# EAGLE design rx (EAGLE 9.1.3)
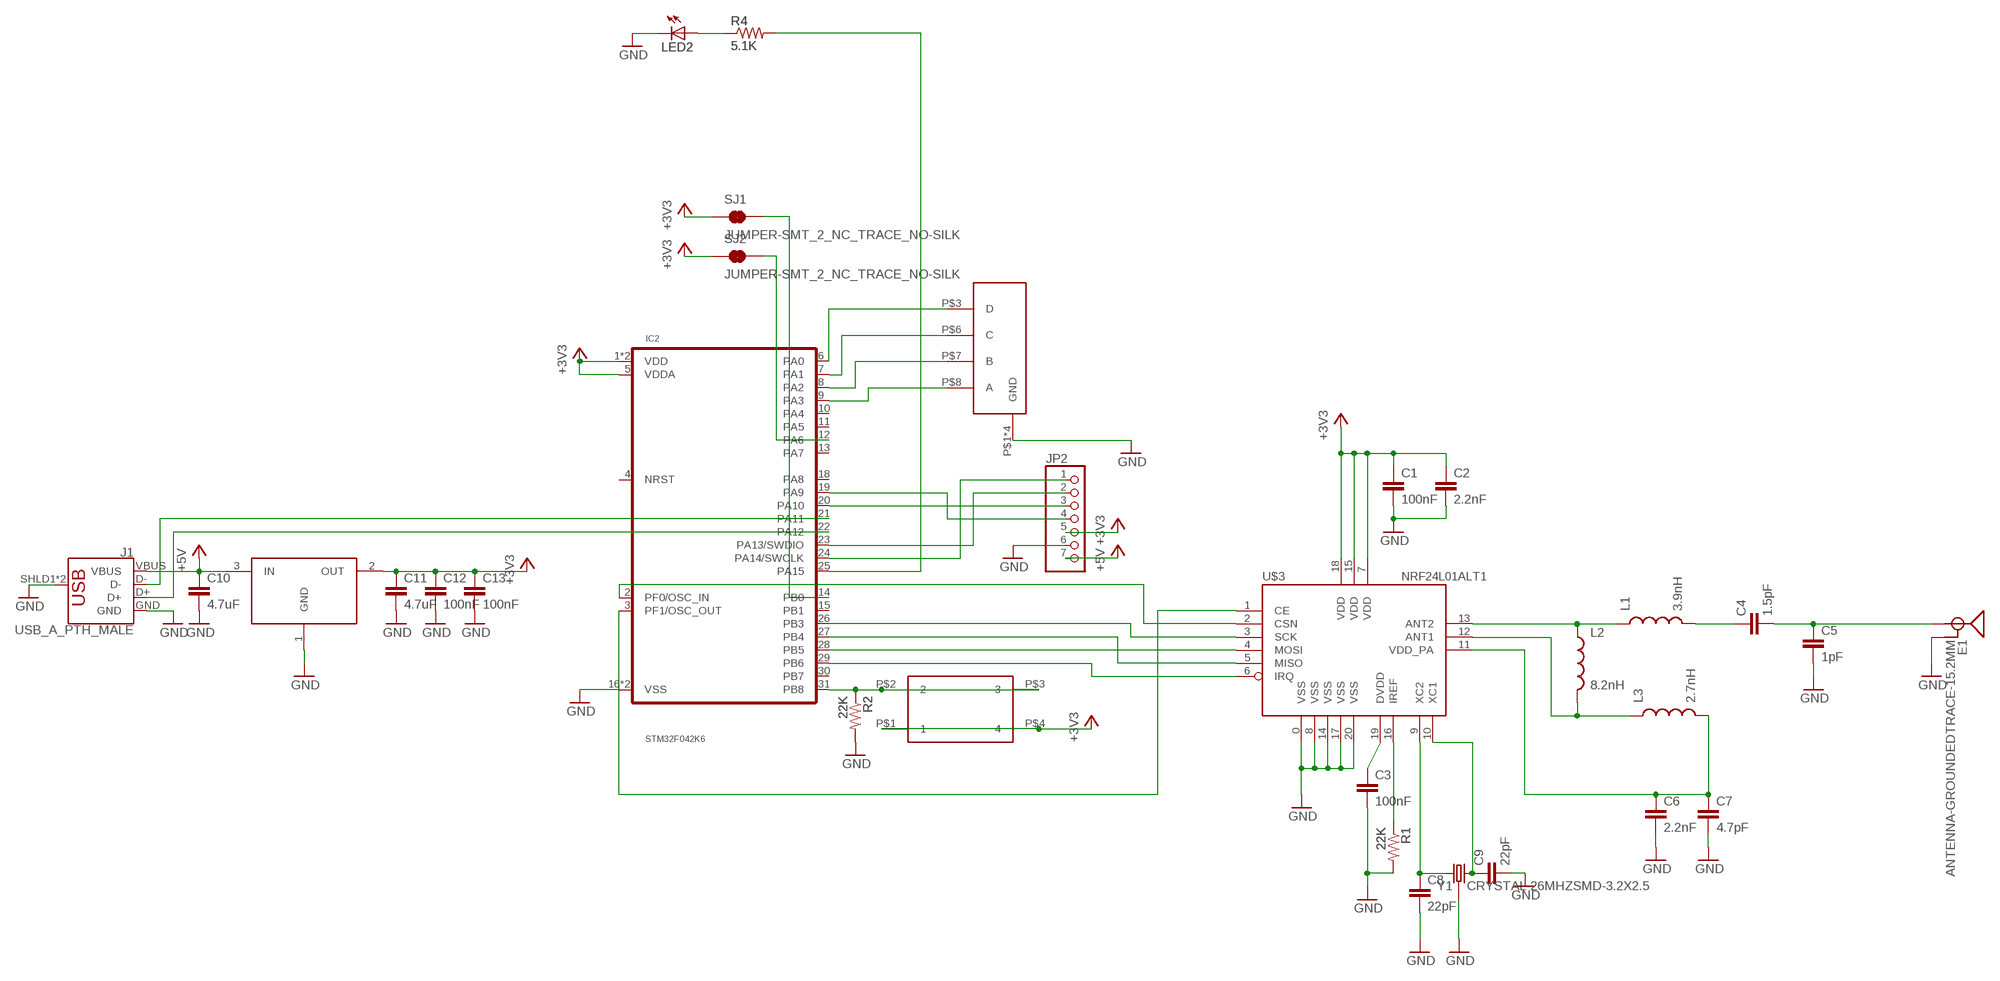
[diagram p0: schematic, sheet 1]

## Parts
C1  100nF  CAP0805  [0805]
C2  2.2nF  CAP0805  [0805]
C3  100nF  CAP0805  [0805]
C4  1.5pF  CAP0805  [0805]
C5  1pF  CAP0805  [0805]
C6  2.2nF  CAP0805  [0805]
C7  4.7pF  CAP0805  [0805]
C8  22pF  CAP0805  [0805]
C9  22pF  CAP0805  [0805]
C10  4.7uF  CAP0805  [0805]
C11  4.7uF  CAP0805  [0805]
C12  100nF  CAP0805  [0805]
C13  100nF  CAP0805  [0805]
E1  ANTENNA-GROUNDEDTRACE-15.2MM  [TRACE_ANTENNA_2.4GHZ_15.2MM]
IC2  STM32F042K6  [TQFP32-08]
J1  USB_A_PTH_MALE  [USB-A-H]
JP2  PINHD-1X8CLEANBIG  [1X08-CLEANBIG]
L1  3.9nH  INDUCTOR0805  [0805]
L2  8.2nH  INDUCTOR0805  [0805]
L3  2.7nH  INDUCTOR0805  [0805]
LED2  LEDCHIP-LED0805  [CHIP-LED0805]
R1  22K  RESISTOR0805-RES  [0805]
R2  22K  RESISTOR0805-RES  [0805]
R4  5.1K  RESISTOR0805-RES  [0805]
SJ1  JUMPER-SMT_2_NC_TRACE_NO-SILK  [SMT-JUMPER_2_NC_TRACE_NO-SILK]
SJ2  JUMPER-SMT_2_NC_TRACE_NO-SILK  [SMT-JUMPER_2_NC_TRACE_NO-SILK]
U$1  SW_3POS_DEVSW_3POS_OFFICIAL  [SW_3POS_FOOT_OFFICIAL]
U$3  NRF24L01ALT1  [QFN20_ALT1]
U$4  XC6206_DEV  [SOT23R_INFINEON]
U$10  324_SW  [342_SWICH_FOOT]
Y1  CRYSTAL-26MHZSMD-3.2X2.5  [CRYSTAL-SMD-3.2X2.5MM]

## Nets
+3V3: C1.1 C2.1 C11.1 C12.1 C13.1 IC2.1(VDD) IC2.5(VDDA) IC2.17(VDD) JP2.5 SJ1.1 SJ2.1 U$3.7(VDD) U$3.15(VDD) U$3.18(VDD) U$4.2(OUT) U$10.P$1 U$10.P$4
+5V: C10.1 J1.VBUS JP2.7 U$4.3(IN)
GND: C1.2 C2.2 C3.2 C5.2 C6.2 C7.2 C8.2 C9.2 C10.2 C11.2 C12.2 C13.2 E1.GND IC2.16(VSS) IC2.32(VSS) J1.GND J1.SHLD1(SHIELD) J1.SHLD2(SHIELD) JP2.6 LED2.C R1.2 R2.2 U$1.P$1(GND) U$1.P$2(GND) U$1.P$4(GND) U$1.P$5(GND) U$3.0(VSS) U$3.8(VSS) U$3.14(VSS) U$3.17(VSS) U$3.20(VSS) U$4.1(GND) Y1.2 Y1.4
N$1: C3.1 U$3.19(DVDD)
N$2: R1.1 U$3.16(IREF)
N$3: L1.1 L2.1 U$3.13(ANT2)
N$4: C4.1 L1.2
N$5: C4.2 C5.1 E1.ANT(SIGNAL)
N$6: L2.2 L3.1 U$3.12(ANT1)
N$7: C8.1 U$3.9(XC2) Y1.1
N$8: C6.1 C7.1 L3.2 U$3.11(VDD_PA)
N$9: C9.1 U$3.10(XC1) Y1.3
N$10: IC2.6(PA0) U$1.P$3(D)
N$11: IC2.31(PB8) R2.1 U$10.P$2 U$10.P$3
N$12: IC2.21(PA11) J1.D-
N$13: IC2.22(PA12) J1.D+
N$14: IC2.28(PB5) U$3.4(MOSI)
N$15: IC2.27(PB4) U$3.5(MISO)
N$16: IC2.26(PB3) U$3.3(SCK)
N$17: IC2.29(PB6) U$3.6(IRQ)
N$18: LED2.A R4.1
N$20: IC2.2(PF0/OSC_IN) U$3.2(CSN)
N$21: IC2.3(PF1/OSC_OUT) U$3.1(CE)
N$22: IC2.24(PA14/SWCLK) JP2.1
N$23: IC2.23(PA13/SWDIO) JP2.2
N$24: IC2.20(PA10) JP2.3
N$25: IC2.19(PA9) JP2.4
N$26: IC2.7(PA1) U$1.P$6(C)
N$27: IC2.8(PA2) U$1.P$7(B)
N$28: IC2.9(PA3) U$1.P$8(A)
N$29: IC2.25(PA15) R4.2
N$33: IC2.12(PA6) SJ2.2
N$34: IC2.14(PB0) SJ1.2
Unconnected: IC2.4(NRST) IC2.10(PA4) IC2.11(PA5) IC2.13(PA7) IC2.15(PB1) IC2.18(PA8) IC2.30(PB7)

## Library data of the parts
C1-C13 = clock:CAP: Capacitor Standard 0603 ceramic capacitor, and 0.1" leaded capacitor.
E1 = SparkFun-RF:ANTENNA-GROUNDED: Antenna w/ Ground Connection 2.4GHz antennae with signal and ground terminals. TRACE_ANTENNA_2.4GHZ_15.2MM - Meander Trace antenna 15.2 x 5.7mm footprint Based on layout from TI app note AN043 <http://www.ti.com/lit/an/swra117d/swra117d.pdf>. TRACE_ANTENNA_2.4GHZ_25.7MM - Inverted F trace antenna 25.7 x 7.5 mm footprint. Based on layout from TI design note DN0007 <http://www.ti.com/lit/an/swru120b/swru120b.pdf>.
IC2 = nixx:STM32F042K6
J1 = SparkFun-Connectors:USB_A: USB-A Connector Male and female variants, as well as PTH and SMT variants SparkFun Products: SparkFun XBee Explorer Dongle <https://www.sparkfun.com/products/11697> PTH Male SparkFun MicroView-USB Programmer <https://www.sparkfun.com/products/12924> SMT Male SparkFun USB Type A Female Breakout <https://www.sparkfun.com/products/12700> SMT Female; PROD_ID: CONN-08367; SF_ID: PRT-00437
JP2 = adafruit_changed:PINHD-1X8: PIN HEADER
L1-L3 = basicBoard:INDUCTOR: Inductors Basic Inductor/Choke - 0603 and 1206. Footprints are not proven and vary greatly between part numbers. INDUCTOR POWER 3.3UH 4.0A SMD 0.197" L x 0.197" W x 0.177" H (5.00mm x 5.00mm x 4.50mm)
LED2 = joyAnalog:LED: LED OSRAM: - CHIPLED LG R971, LG N971, LY N971, LG Q971, LY Q971, LO R971, LY R971 LH N974, LH R974 LS Q976, LO Q976, LY Q976 LO Q996 - Hyper CHIPLED LW Q18S LB Q993, LB Q99A, LB R99A - SideLED LS A670, LO A670, LY A670, LG A670, LP A670 LB A673, LV A673, LT A673, LW A673 LH A674 LY A675 LS A676, LA A676, LO A676, LY A676, LW A676 LS A679, LY A679, LG A679 - Hyper Micro SIDELED® LS Y876, LA Y876, LO Y876, LY Y876 LT Y87S - SmartLED LW L88C, LW L88S LB L89C, LB L89S, LG L890 LS L89K, LO L89K, LY L89K LS L896, LA L896, LO L896, LY L896 - TOPLED LS T670, LO T670, LY T670, LG T670, LP T670 LSG T670, LSP T670, LSY T670, LOP T670, LYG T670 LG T671, LOG T671, LSG T671 LB T673, LV T673, LT T673, LW T673 LH T674 LS T676, LA T676, LO T676, LY T676, LB T676, LH T676, LSB T676, LW T676 LB T67C, LV T67C, LT T67C, LS T67K, LO T67K, LY T67K, LW E67C LS E67B, LA E67B, LO E67B, LY E67B, LB E67C, LV E67C, LT E67C LW T67C LS T679, LY T679, LG T679 LS T770, LO T770, LY T770, LG T770, LP T770 LB T773, LV T773, LT T773, LW T773 LH T774 LS E675, LA E675, LY E675, LS T675 LS T776, LA T776, LO T776, LY T776, LB T776 LHGB T686 LT T68C, LB T68C - Hyper Mini TOPLED® LB M676 - Mini TOPLED Santana® LG M470 LS M47K, LO M47K, LY M47K Source: http://www.osram.convergy.de/
R1 R2 R4 = joyAnalog:RESISTOR: Resistor Basic schematic elements and footprints for 0603, 1206, and PTH resistors.
SJ1 SJ2 = SparkFun-Jumpers:JUMPER-SMT_2_NC_TRACE: Normally closed trace jumper This jumper has a trace between two pads so it's normally closed (NC). Use a razor knife to open the connection. For best results follow the IPC guidelines for cutting traces: Cutout at least 0.063 mm (0.005 in). Remove all loose material to clean up the cut area. Seal the cut with an approved epoxy. Reapply solder to reclose the connection.
U$1 = 3pos_slide_switch:SW_3POS_DEV
U$3 = nRF24L01-Chip-v13:NRF24L01: 2.4GHz Low Power Transceiver This is the very popular, low cost, very low power RF transceiver from Nordic Semiconductor. Simple SPI interface. SKU: COM-00690
U$4 = 3pos_slide_switch:XC6206_DEV
U$10 = 3pos_slide_switch:324_SW
Y1 = SparkFun-Clocks:CRYSTAL-26MHZ: 26MHz Crystal w/ Ground Pin Digikey Example <http://www.digikey.com/product-detail/en/epson/TSX-3225%2026.0000MF09Z-AC3/SER3627CT-ND/1802878> Frequency: 26MHz Frequency Stability: ±9ppm Frequency Tolerance: ±10ppm Load Capacitance: 9pF SparkFun Products: SparkFun ESP32 Thing <https://www.sparkfun.com/products/13907> SparkFun ESP8266 Thing Dev Board <https://www.sparkfun.com/products/13711>; PROD_ID: XTAL-12454

## Board
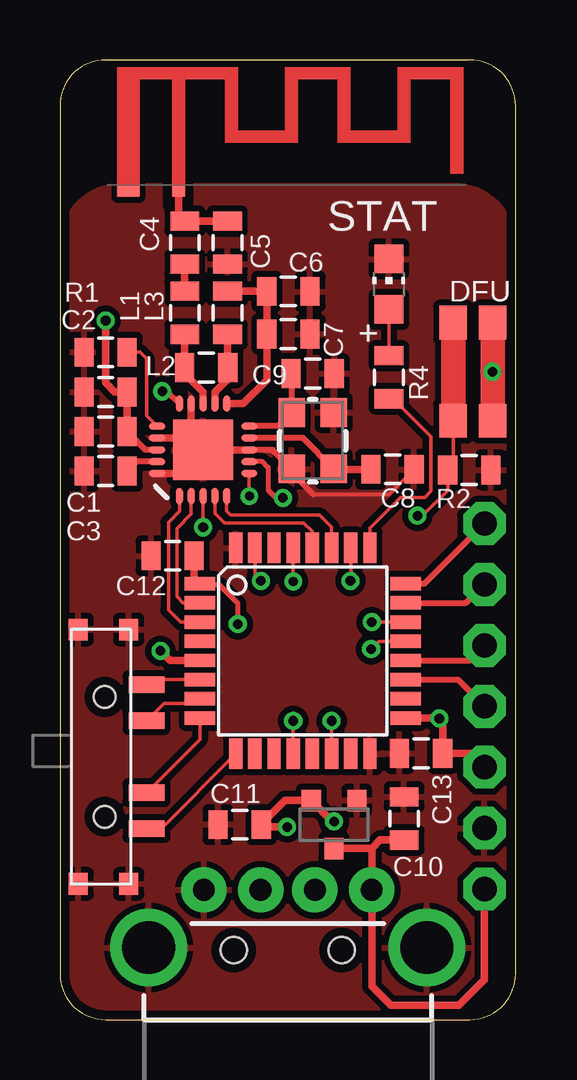
[diagram p1: board, top side]
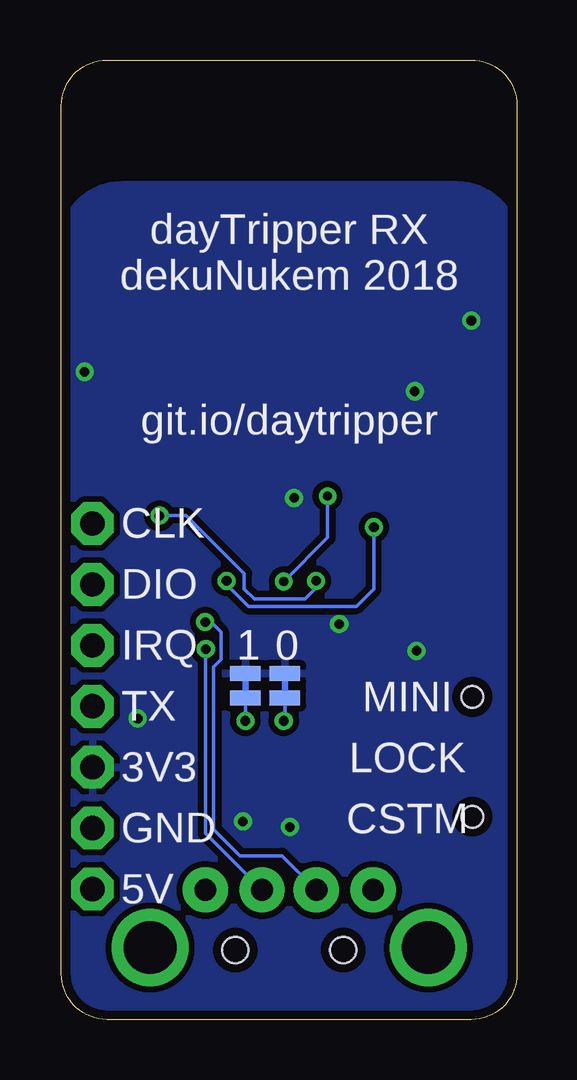
[diagram p2: board, bottom side, seen from below]

Size 19 x 40 mm. Coordinates in mm from the lower left corner, seen from the top.
Outline: 0,38.09 0,1.91 arc90 1.91,0 17.09,0 arc90 19,1.91 19,38.09 arc90 17.09,40 1.91,40 arc90 0,38.09
Copper layers (1*16): Top 0.035mm / dielectric 1.5mm / Bottom 0.035mm
Design rules "SparkFun-2-layer-TIGHT *": minimum track width 6mil, minimum drill 15mil, track to track 6mil, track to pad 6mil, pad to pad 6mil, via to via 6mil, smd to smd 6mil, copper to edge 15mil, drill to drill 6mil, minimum pad ring 7mil, minimum via ring 7mil, stop-mask expansion 4mil, vias tented up to drill 25mil, thermal gap 10mil
tRestrict: area 4.6,33.8 to 5.2,35

### Footprints (pad centres in the part's own frame; a part is rotated, then mirrored left to right if it is on the bottom)
0805 = smd 0.8 x 1.2: 1 -0.9,0; 2 0.9,0
TRACE_ANTENNA_2.4GHZ_15.2MM = smd 0.5 x 0.5: ANT 0,-0.25 | smd 0.9 x 0.5: GND -2.1,-0.25
TQFP32-08 = smd 1.27 x 0.559: 1 -4.293,2.8; 2 -4.293,2; 3 -4.293,1.2; 4 -4.293,0.4; 5 -4.293,-0.4; 6 -4.293,-1.2; 7 -4.293,-2; 8 -4.293,-2.8; 17 4.293,-2.8; 18 4.293,-2; 19 4.293,-1.2; 20 4.293,-0.4; 21 4.293,0.4; 22 4.293,1.2; 23 4.293,2; 24 4.293,2.8 | smd 0.559 x 1.27: 9 -2.8,-4.293; 10 -2,-4.293; 11 -1.2,-4.293; 12 -0.4,-4.293; 13 0.4,-4.293; 14 1.2,-4.293; 15 2,-4.293; 16 2.8,-4.293; 25 2.8,4.293; 26 2,4.293; 27 1.2,4.293; 28 0.4,4.293; 29 -0.4,4.293; 30 -1.2,4.293; 31 -2,4.293; 32 -2.8,4.293
USB-A-H = drill 0.914 pad 1.88: D+ 2.4,1.127; D- 2.4,-1.127; GND 2.4,3.5; VBUS 2.4,-3.5 | drill 2.2: SHLD1 0,-5.8; SHLD2 0,5.8 | hole 1.1: -0.1,2.25; -0.1,-2.25
1X08-CLEANBIG = drill 1.016 pad 1.778 octagon: 1 -8.89,0; 2 -6.35,0; 3 -3.81,0; 4 -1.27,0; 5 1.27,0; 6 3.81,0; 7 6.35,0
CHIP-LED0805 = smd 1.2 x 1.2: A 0,-1.05; C 0,1.05
SMT-JUMPER_2_NC_TRACE_NO-SILK = smd 0.635 x 1.27: 1 -0.508,0; 2 0.508,0
SW_3POS_FOOT_OFFICIAL = smd 0.9 x 0.8: P$1 0,0; P$2 0,2.1; P$4 10.6,2.1; P$5 10.6,0 | smd 0.7 x 1.5: P$3 2.3,2.85; P$6 3.8,2.85; P$7 6.8,2.85; P$8 8.3,2.85 | hole 0.9: 2.8,1.1; 7.8,1.1
QFN20_ALT1 = smd 2.515 x 2.515: 0 0,0 | smd 0.686 x 0.293: 1 -1.925,0.986; 2 -1.925,0.493; 3 -1.925,0; 4 -1.925,-0.493; 5 -1.925,-0.986; 11 1.925,-0.986; 12 1.925,-0.493; 13 1.925,0; 14 1.925,0.493; 15 1.925,0.986 | smd 0.293 x 0.686: 6 -0.986,-1.925; 7 -0.493,-1.925; 8 0,-1.925; 9 0.493,-1.925; 10 0.986,-1.925; 16 0.986,1.925; 17 0.493,1.925; 18 0,1.925; 19 -0.493,1.925; 20 -0.986,1.925
SOT23R_INFINEON = smd 0.8 x 0.9: 1 -0.95,-1; 2 0.95,-1; 3 0,1
342_SWICH_FOOT = smd 1.4 x 1.15: P$1 -2.05,-0.825; P$2 -2.05,0.825; P$3 2.05,0.825; P$4 2.05,-0.825
CRYSTAL-SMD-3.2X2.5MM = smd 1.2 x 1.1: 1 -1.175,-0.875; 2 1.175,-0.875; 3 1.175,0.875; 4 -1.175,0.875

### Placement (x,y rotation side)
C1  1.91,24.51 180 top
C2  1.91,26.16 180 top
C3  1.91,22.86 180 top
C4  5.21,32.38 90 top
C5  6.99,32.38 270 top
C6  9.53,30.35 0 top
C7  9.53,28.57 0 top
C8  13.87,22.94 0 top
C9  10.54,26.92 0 top
C10  14.35,8.38 90 top
C11  7.49,8.13 180 top
C12  4.7,19.33 180 top
C13  15.06,11.1 180 top
E1  4.95,34.8 0 top
IC2  10.13,15.37 0 top
J1  9.5,3 90 top
JP2  17.7,11.79 270 top
L1  5.21,29.46 90 top
L2  6.1,27.18 0 top
L3  6.99,29.46 90 top
LED2  13.72,30.66 0 top
R1  1.91,27.81 180 top
R2  17.07,22.91 0 top
R4  13.72,26.77 270 top
SJ1  11.33,13.92 270 bottom
SJ2  9.68,13.92 270 bottom
U$1  0.76,16.26 270 top
U$3  5.97,23.75 90 top
U$4  11.43,8.13 180 top
U$10  17.22,27 90 top
Y1  10.54,24.13 90 top

### Tracks (layer width: path | path; a pad name or v marks a point on that pad's centre or on a via)
+3V3  (via drill 0.4)
  Top 0.203: v7.42,16.48 7.42,17.35 6.66,18.11 5.89,18.11 | U$3.7 8.44,23.26 8.69,23.01 8.69,22.07 9.02,21.74 v9.3,21.74
  Top 0.254: U$3.15 4.47,26.19 v4.27,26.19 | U$3.18 3.57,23.75 C1.1
  Top 0.305: C1.1 C2.1 2.29,26.16 1.91,26.54 v1.91,29.13 | C12.1 5.6,18.4 IC2.1 5.89,18.11 | v11.43,8.26 11.35,8.26 U$4.2 9.39,9.13 C11.1 8.49,8.03 v9.47,8.03 | IC2.17 15.8,12.57 v15.82,12.55 15.96,12.41 C13.1 17.12,11.1 JP2.5 | v4.19,15.37 4.59,14.97 IC2.5
  Top 1.016: U$10.P$4 18.05,27.01 | 18.05,27.01 v18.03,27 | U$10.P$1 18.05,27.01
  pour Bottom (isolate 0.254): 19,0 19,32.26 arc90 16.46,34.8 2.54,34.8 arc90 0,32.26 0,0
+5V
  Top 0.305: 13,7.13 J1.VBUS 13,1.38 13.79,0.58 16.64,0.58 17.7,1.65 JP2.7 | 13,7.13 U$4.3 | 13,7.13 13.35,7.48 C10.1
GND
  Top 0.152: C8.2 13.73,21.89 10.57,21.89 | 9.67,22.8 Y1.4
  Top 0.254: Y1.4 8.87,23.75 8.56,23.75 U$3.8 | 10.57,21.89 9.67,22.8
  Top 0.305: U$3.8 U$3.0 | U$3.0 5.48,23.75 5.48,24.26 | 5.48,24.26 U$3.14 | U$3.17 5.48,24.24 5.48,24.26 | U$3.20 5.97,22.76 U$3.0
  pour Top (isolate 0.254): 19,0 19,32.26 arc90 16.46,34.8 2.54,34.8 arc90 0,32.26 0,0
N$1
  Top 0.254: U$3.19 3.2,23.26 C3.1
N$2
  Top 0.152: R1.1 3.35,27.81 3.61,27.56 3.61,25.17 U$3.16
N$3
  Top 0.305: U$3.13 5.97,26.16 5.2,26.93 L2.1 L1.1
N$4
  Top 0.305: L1.2 C4.1
N$5
  Top 0.305: C5.1 C4.2 4.95,33.54 E1.ANT
N$6
  Top 0.305: U$3.12 6.46,26.15 7,26.68 L2.2 6.99,27.19 L3.1
N$7
  Top 0.254: U$3.9 10.13,24.24 Y1.1 11.45,22.99
  Top 0.305: C8.1 11.5,22.94 11.45,22.99
N$8
  Top 0.305: L3.2 8.61,30.36 C6.1 C7.1 8.62,26.66 7.64,25.67 U$3.11
N$9
  Top 0.254: U$3.10 9.1,24.73 Y1.3 9.67,26.9 C9.1
N$10
  Top 0.152: U$1.P$3 3.82,14.17 IC2.6
N$11  (via drill 0.4)
  Top 0.152: IC2.31 8.13,18.54 v8.38,18.29 | v14.91,21.01 15.11,21.01 16.17,22.06 R2.1 16.4,23.14 U$10.P$2
  Top 1.016: U$10.P$3 U$10.P$2
  Bottom 0.152: v8.38,18.29 8.38,17.98 8.84,17.53 10.95,17.53 11.38,17.96 11.38,18.59 13.79,21.01 v14.91,21.01
N$12  (via drill 0.4)
  Top 0.152: IC2.21 13.3,15.77 v12.98,15.44
  Bottom 0.152: v12.98,15.44 12.98,7.75 J1.D-
N$13  (via drill 0.4)
  Top 0.152: IC2.22 v13.01,16.57
  Bottom 0.152: v13.01,16.57 12.76,16.57 12.34,16.15 12.34,15.01 12.65,14.71 12.65,7.92 11.56,6.83 9.81,6.83 J1.D+
N$14
  Top 0.152: IC2.28 10.53,20.33 10.16,20.7 6.86,20.7 6.46,21.1 U$3.4
N$15
  Top 0.152: U$3.5 6.96,21.19 7.11,21.03 10.82,21.03 11.33,20.52 IC2.27
N$16  (via drill 0.4)
  Top 0.152: U$3.3 5.97,20.55 v5.97,20.52 | IC2.26 v12.13,18.3 v12.12,18.29
  Bottom 0.152: v12.12,18.29 12.12,18.14 11.2,17.22 6.71,17.22 5.97,17.96 v5.97,20.52
N$17  (via drill 0.38)
  Top 0.152: U$3.6 v7.89,21.82 v7.9,21.82 | v9.73,18.26 IC2.29
  Bottom 0.152: v7.9,21.82 7.9,20.09 v9.73,18.26
N$18
  Top 0.152: LED2.A R4.1
N$20
  Top 0.152: U$3.2 5.48,21.07 4.88,20.47 4.88,17.63 5.14,17.37 IC2.2
N$21
  Top 0.152: IC2.3 5.02,16.57 4.52,17.07 4.52,20.73 4.98,21.19 U$3.1
N$22
  Top 0.254: IC2.24 15.2,18.17 JP2.1
N$23
  Top 0.254: IC2.23 16.93,17.37 JP2.2
N$24
  Top 0.254: IC2.20 17.07,14.97 JP2.3
N$25
  Top 0.254: IC2.19 16.59,14.17 JP2.4
N$26
  Top 0.152: U$1.P$6 4.34,13.18 5.65,13.18 IC2.7
N$27
  Top 0.152: IC2.8 5.83,11.68 U$1.P$7
N$28
  Top 0.152: U$1.P$8 4.21,7.96 IC2.9
N$29
  Top 0.152: IC2.25 12.93,20.5 14.2,21.77 15.21,21.77 15.47,22.02 15.47,24.31 13.9,25.87 R4.2
N$33  (via drill 0.4)
  Top 0.152: v9.73,12.45 IC2.12
  Bottom 0.152: SJ2.2 9.68,12.5 v9.73,12.45
N$34  (via drill 0.4)
  Top 0.152: v11.33,12.45 IC2.14
  Bottom 0.152: SJ1.2 v11.33,12.45

### Text on the board
tNames: STAT | DFU
bNames: dayTripper RX / dekuNukem 2018 | git.io/daytripper | CLK | DIO | 0 | 1 | IRQ | MINI | TX | LOCK | 3V3 | CSTM | GND | 5V